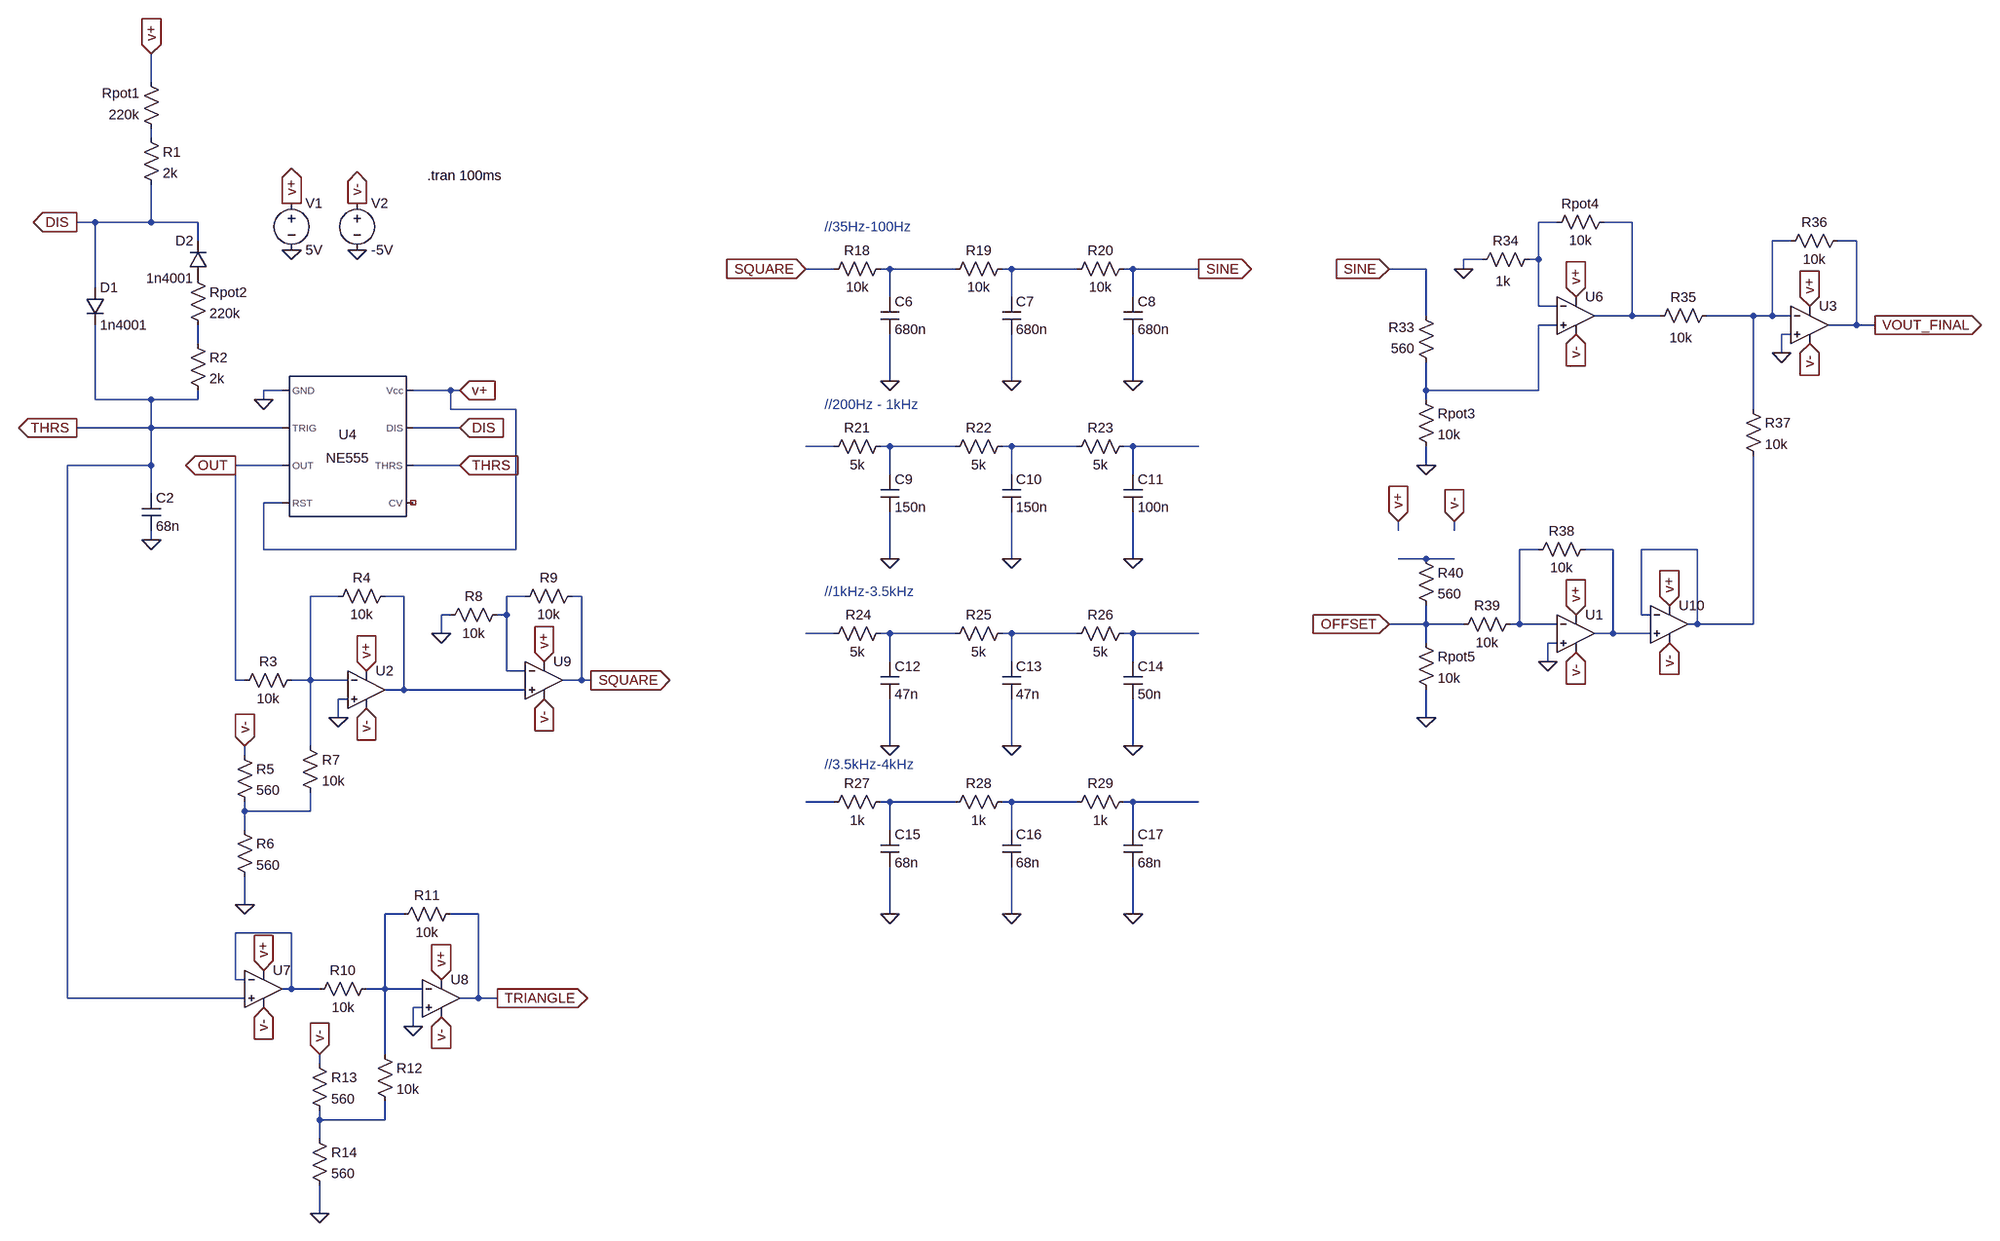
[diagram p0: schematic NE555 signal generator schematic.asc]
NE555 signal generator schematic.asc, the LTspice schematic file:
Version 4
SHEET 1 3212 2508
WIRE -1360 -400 -1360 -448
WIRE -1360 -304 -1360 -320
WIRE -1456 -160 -1488 -160
WIRE -1360 -160 -1360 -224
WIRE -1360 -160 -1456 -160
WIRE -1280 -160 -1360 -160
WIRE 1104 -160 1072 -160
WIRE 1232 -160 1184 -160
WIRE -1280 -128 -1280 -160
WIRE 1504 -128 1472 -128
WIRE 1616 -128 1584 -128
WIRE 976 -96 944 -96
WIRE 1072 -96 1072 -160
WIRE 1072 -96 1056 -96
WIRE -192 -80 -240 -80
WIRE -96 -80 -112 -80
WIRE 16 -80 -96 -80
WIRE 112 -80 96 -80
WIRE 224 -80 112 -80
WIRE 320 -80 304 -80
WIRE 432 -80 320 -80
WIRE 880 -80 816 -80
WIRE 944 -80 944 -96
WIRE -1456 -48 -1456 -160
WIRE -96 -32 -96 -80
WIRE 112 -32 112 -80
WIRE 320 -32 320 -80
WIRE 1072 -16 1072 -96
WIRE 1104 -16 1072 -16
WIRE 880 0 880 -80
WIRE 1232 0 1232 -160
WIRE 1232 0 1168 0
WIRE 1280 0 1232 0
WIRE 1440 0 1360 0
WIRE 1472 0 1472 -128
WIRE 1472 0 1440 0
WIRE 1504 0 1472 0
WIRE 1104 16 1072 16
WIRE 1616 16 1616 -128
WIRE 1616 16 1568 16
WIRE 1648 16 1616 16
WIRE 1504 32 1488 32
WIRE -1280 48 -1280 16
WIRE 1488 64 1488 32
WIRE -96 112 -96 32
WIRE 112 112 112 32
WIRE 320 112 320 32
WIRE -1136 128 -1168 128
WIRE -848 128 -912 128
WIRE -832 128 -848 128
WIRE 880 128 880 80
WIRE 1072 128 1072 16
WIRE 1072 128 880 128
WIRE -1456 144 -1456 16
WIRE -1360 144 -1456 144
WIRE -1280 144 -1280 128
WIRE -1280 144 -1360 144
WIRE -1168 144 -1168 128
WIRE 880 144 880 128
WIRE -848 160 -848 128
WIRE -736 160 -848 160
WIRE 1440 160 1440 0
WIRE -1360 192 -1360 144
WIRE -1360 192 -1488 192
WIRE -1136 192 -1360 192
WIRE -832 192 -912 192
WIRE -192 224 -240 224
WIRE -96 224 -112 224
WIRE 16 224 -96 224
WIRE 112 224 96 224
WIRE 224 224 112 224
WIRE 320 224 304 224
WIRE 432 224 320 224
WIRE -1360 256 -1360 192
WIRE -1360 256 -1504 256
WIRE -1136 256 -1216 256
WIRE -832 256 -912 256
WIRE 880 256 880 224
WIRE -96 272 -96 224
WIRE 112 272 112 224
WIRE 320 272 320 224
WIRE -1360 304 -1360 256
WIRE -1136 320 -1168 320
WIRE 832 368 832 352
WIRE 928 368 928 352
WIRE -1360 384 -1360 368
WIRE -1168 400 -1168 320
WIRE -736 400 -736 160
WIRE -736 400 -1168 400
WIRE 1072 400 1040 400
WIRE 1200 400 1152 400
WIRE 1344 400 1248 400
WIRE -96 416 -96 336
WIRE 112 416 112 336
WIRE 320 416 320 336
WIRE 880 416 832 416
WIRE 928 416 880 416
WIRE -1040 480 -1088 480
WIRE -928 480 -960 480
WIRE -720 480 -752 480
WIRE -624 480 -640 480
WIRE -848 512 -864 512
WIRE -752 512 -752 480
WIRE -752 512 -768 512
WIRE 1248 512 1248 400
WIRE 1264 512 1248 512
WIRE 880 528 880 496
WIRE 880 528 816 528
WIRE 944 528 880 528
WIRE 1040 528 1040 400
WIRE 1040 528 1024 528
WIRE 1104 528 1040 528
WIRE 1344 528 1344 400
WIRE 1344 528 1328 528
WIRE 1440 528 1440 240
WIRE 1440 528 1344 528
WIRE -864 544 -864 512
WIRE -192 544 -240 544
WIRE -96 544 -112 544
WIRE 16 544 -96 544
WIRE 112 544 96 544
WIRE 224 544 112 544
WIRE 320 544 304 544
WIRE 432 544 320 544
WIRE 1200 544 1200 400
WIRE 1200 544 1168 544
WIRE 1264 544 1200 544
WIRE 880 560 880 528
WIRE 1104 560 1088 560
WIRE -96 592 -96 544
WIRE 112 592 112 544
WIRE 320 592 320 544
WIRE 1088 592 1088 560
WIRE -752 608 -752 512
WIRE -720 608 -752 608
WIRE -1216 624 -1216 256
WIRE -1200 624 -1216 624
WIRE -1088 624 -1088 480
WIRE -1088 624 -1120 624
WIRE -1024 624 -1088 624
WIRE -624 624 -624 480
WIRE -624 624 -656 624
WIRE -608 624 -624 624
WIRE -928 640 -928 480
WIRE -928 640 -960 640
WIRE -720 640 -928 640
WIRE -1024 656 -1040 656
WIRE -1040 688 -1040 656
WIRE 880 688 880 640
WIRE -1088 736 -1088 624
WIRE -96 736 -96 656
WIRE 112 736 112 656
WIRE 320 736 320 656
WIRE -1200 752 -1200 736
WIRE -192 832 -240 832
WIRE -96 832 -112 832
WIRE 16 832 -96 832
WIRE 112 832 96 832
WIRE 224 832 112 832
WIRE 320 832 304 832
WIRE 432 832 320 832
WIRE -1200 848 -1200 832
WIRE -1088 848 -1088 816
WIRE -1088 848 -1200 848
WIRE -1200 880 -1200 848
WIRE -96 880 -96 832
WIRE 112 880 112 832
WIRE 320 880 320 832
WIRE -1200 1008 -1200 960
WIRE -928 1024 -960 1024
WIRE -800 1024 -848 1024
WIRE -96 1024 -96 944
WIRE 112 1024 112 944
WIRE 320 1024 320 944
WIRE -1120 1056 -1216 1056
WIRE -1216 1136 -1216 1056
WIRE -1200 1136 -1216 1136
WIRE -1120 1152 -1120 1056
WIRE -1120 1152 -1136 1152
WIRE -1072 1152 -1120 1152
WIRE -960 1152 -960 1024
WIRE -960 1152 -992 1152
WIRE -896 1152 -960 1152
WIRE -1504 1168 -1504 256
WIRE -1200 1168 -1504 1168
WIRE -800 1168 -800 1024
WIRE -800 1168 -832 1168
WIRE -768 1168 -800 1168
WIRE -896 1184 -912 1184
WIRE -912 1216 -912 1184
WIRE -960 1264 -960 1152
WIRE -1072 1280 -1072 1264
WIRE -1072 1376 -1072 1360
WIRE -960 1376 -960 1344
WIRE -960 1376 -1072 1376
WIRE -1072 1408 -1072 1376
WIRE -1072 1536 -1072 1488
FLAG -1120 -112 0
FLAG -1120 -192 v+
IOPIN -1120 -192 Out
FLAG 1648 16 VOUT_FINAL
IOPIN 1648 16 Out
FLAG -832 256 THRS
IOPIN -832 256 In
FLAG -1488 192 THRS
IOPIN -1488 192 Out
FLAG -832 192 DIS
IOPIN -832 192 In
FLAG -832 128 v+
IOPIN -832 128 In
FLAG -1008 -112 0
FLAG -1008 -192 v-
IOPIN -1008 -192 Out
FLAG 944 -80 0
FLAG 1536 -16 v+
IOPIN 1536 -16 In
FLAG 1536 48 v-
IOPIN 1536 48 In
FLAG 832 352 v+
IOPIN 832 352 In
FLAG 880 688 0
FLAG 816 528 OFFSET
IOPIN 816 528 In
FLAG 880 256 0
FLAG 928 352 v-
IOPIN 928 352 In
FLAG 112 1024 0
FLAG 320 1024 0
FLAG -96 736 0
FLAG 112 736 0
FLAG 320 736 0
FLAG -96 112 0
FLAG 112 112 0
FLAG 320 112 0
FLAG -768 1168 TRIANGLE
IOPIN -768 1168 Out
FLAG -1488 -160 DIS
IOPIN -1488 -160 Out
FLAG -96 1024 0
FLAG -1360 384 0
FLAG -1360 -448 v+
IOPIN -1360 -448 In
FLAG 1136 -32 v+
IOPIN 1136 -32 In
FLAG 1136 32 v-
IOPIN 1136 32 In
FLAG -1168 144 0
FLAG 1488 64 0
FLAG -992 608 v+
IOPIN -992 608 In
FLAG -992 672 v-
IOPIN -992 672 In
FLAG -1040 688 0
FLAG -1200 736 v-
IOPIN -1200 736 In
FLAG -1200 1008 0
FLAG -1168 1120 v+
IOPIN -1168 1120 In
FLAG -1168 1184 v-
IOPIN -1168 1184 In
FLAG -864 1136 v+
IOPIN -864 1136 In
FLAG -864 1200 v-
IOPIN -864 1200 In
FLAG -912 1216 0
FLAG -1072 1264 v-
IOPIN -1072 1264 In
FLAG -1072 1536 0
FLAG -608 624 SQUARE
IOPIN -608 624 Out
FLAG 816 -80 SINE
IOPIN 816 -80 In
FLAG -688 592 v+
IOPIN -688 592 In
FLAG -688 656 v-
IOPIN -688 656 In
FLAG -96 416 0
FLAG 112 416 0
FLAG 320 416 0
FLAG -864 544 0
FLAG 1136 512 v+
IOPIN 1136 512 In
FLAG 1136 576 v-
IOPIN 1136 576 In
FLAG 1088 592 0
FLAG 1296 496 v+
IOPIN 1296 496 In
FLAG 1296 560 v-
IOPIN 1296 560 In
FLAG 432 -80 SINE
IOPIN 432 -80 Out
FLAG -240 -80 SQUARE
IOPIN -240 -80 In
FLAG -1216 256 OUT
IOPIN -1216 256 Out
SYMBOL voltage -1120 -208 R0
WINDOW 123 0 0 Left 0
WINDOW 39 0 0 Left 0
SYMATTR InstName V1
SYMATTR Value 5V
SYMBOL res 1200 -176 R90
WINDOW 0 0 56 VBottom 2
WINDOW 3 32 56 VTop 2
SYMATTR InstName Rpot4
SYMATTR Value 10k
SYMBOL res 1072 -112 R90
WINDOW 0 0 56 VBottom 2
WINDOW 3 38 60 VTop 2
SYMATTR InstName R34
SYMATTR Value 1k
SYMBOL Misc\\NE555 -1024 224 R0
SYMATTR InstName U4
SYMBOL cap -1376 304 R0
SYMATTR InstName C2
SYMATTR Value 68n
SYMBOL res -1296 -80 R0
SYMATTR InstName Rpot2
SYMATTR Value 220k
SYMBOL voltage -1008 -208 R0
WINDOW 123 0 0 Left 0
WINDOW 39 0 0 Left 0
SYMATTR InstName V2
SYMATTR Value -5V
SYMBOL OpAmps\\UniversalOpAmp2 1536 16 R0
SYMATTR InstName U3
SYMBOL res 1376 -16 R90
WINDOW 0 0 56 VBottom 2
WINDOW 3 38 60 VTop 2
SYMATTR InstName R35
SYMATTR Value 10k
SYMBOL res 864 544 R0
SYMATTR InstName Rpot5
SYMATTR Value 10k
SYMBOL res 864 400 R0
SYMATTR InstName R40
SYMATTR Value 560
SYMBOL res 896 96 R180
WINDOW 0 36 76 Left 2
WINDOW 3 36 40 Left 2
SYMATTR InstName R33
SYMATTR Value 560
SYMBOL res 864 128 R0
SYMATTR InstName Rpot3
SYMATTR Value 10k
SYMBOL res -96 816 R90
WINDOW 0 0 56 VBottom 2
WINDOW 3 32 56 VTop 2
SYMATTR InstName R27
SYMATTR Value 1k
SYMBOL cap -112 880 R0
SYMATTR InstName C15
SYMATTR Value 68n
SYMBOL res -1344 -304 R180
WINDOW 0 36 76 Left 2
WINDOW 3 36 40 Left 2
SYMATTR InstName Rpot1
SYMATTR Value 220k
SYMBOL cap -112 592 R0
SYMATTR InstName C12
SYMATTR Value 47n
SYMBOL res -96 -96 R90
WINDOW 0 0 56 VBottom 2
WINDOW 3 32 56 VTop 2
SYMATTR InstName R18
SYMATTR Value 10k
SYMBOL cap -112 -32 R0
SYMATTR InstName C6
SYMATTR Value 680n
SYMBOL cap 96 -32 R0
SYMATTR InstName C7
SYMATTR Value 680n
SYMBOL cap 304 -32 R0
SYMATTR InstName C8
SYMATTR Value 680n
SYMBOL res 112 -96 R90
WINDOW 0 0 56 VBottom 2
WINDOW 3 32 56 VTop 2
SYMATTR InstName R19
SYMATTR Value 10k
SYMBOL res 320 -96 R90
WINDOW 0 0 56 VBottom 2
WINDOW 3 32 56 VTop 2
SYMATTR InstName R20
SYMATTR Value 10k
SYMBOL res 112 816 R90
WINDOW 0 0 56 VBottom 2
WINDOW 3 32 56 VTop 2
SYMATTR InstName R28
SYMATTR Value 1k
SYMBOL res 320 816 R90
WINDOW 0 0 56 VBottom 2
WINDOW 3 32 56 VTop 2
SYMATTR InstName R29
SYMATTR Value 1k
SYMBOL res 112 528 R90
WINDOW 0 0 56 VBottom 2
WINDOW 3 32 56 VTop 2
SYMATTR InstName R25
SYMATTR Value 5k
SYMBOL res 320 528 R90
WINDOW 0 0 56 VBottom 2
WINDOW 3 32 56 VTop 2
SYMATTR InstName R26
SYMATTR Value 5k
SYMBOL cap 96 592 R0
SYMATTR InstName C13
SYMATTR Value 47n
SYMBOL cap 304 592 R0
SYMATTR InstName C14
SYMATTR Value 50n
SYMBOL cap 96 880 R0
SYMATTR InstName C16
SYMATTR Value 68n
SYMBOL cap 304 880 R0
SYMATTR InstName C17
SYMATTR Value 68n
SYMBOL res -96 528 R90
WINDOW 0 0 54 VBottom 2
WINDOW 3 32 56 VTop 2
SYMATTR InstName R24
SYMATTR Value 5k
SYMBOL res 1424 144 R0
SYMATTR InstName R37
SYMATTR Value 10k
SYMBOL OpAmps\\UniversalOpAmp2 1136 0 R0
SYMATTR InstName U6
SYMBOL res 1488 -112 R270
WINDOW 0 32 56 VTop 2
WINDOW 3 0 56 VBottom 2
SYMATTR InstName R36
SYMATTR Value 10k
SYMBOL OpAmps\\UniversalOpAmp2 -992 640 R0
SYMATTR InstName U2
SYMBOL res -1104 608 R90
WINDOW 0 0 56 VBottom 2
WINDOW 3 32 56 VTop 2
SYMATTR InstName R3
SYMATTR Value 10k
SYMBOL res -944 464 R90
WINDOW 0 0 56 VBottom 2
WINDOW 3 32 56 VTop 2
SYMATTR InstName R4
SYMATTR Value 10k
SYMBOL res -1104 720 R0
SYMATTR InstName R7
SYMATTR Value 10k
SYMBOL res -1216 864 R0
SYMATTR InstName R6
SYMATTR Value 560
SYMBOL res -1216 736 R0
SYMATTR InstName R5
SYMATTR Value 560
SYMBOL OpAmps\\UniversalOpAmp2 -1168 1152 R0
SYMATTR InstName U7
SYMBOL OpAmps\\UniversalOpAmp2 -864 1168 R0
SYMATTR InstName U8
SYMBOL res -976 1136 R90
WINDOW 0 0 56 VBottom 2
WINDOW 3 32 56 VTop 2
SYMATTR InstName R10
SYMATTR Value 10k
SYMBOL res -832 1008 R90
WINDOW 0 0 56 VBottom 2
WINDOW 3 32 56 VTop 2
SYMATTR InstName R11
SYMATTR Value 10k
SYMBOL res -976 1248 R0
SYMATTR InstName R12
SYMATTR Value 10k
SYMBOL res -1088 1392 R0
SYMATTR InstName R14
SYMATTR Value 560
SYMBOL res -1088 1264 R0
SYMATTR InstName R13
SYMATTR Value 560
SYMBOL diode -1472 -48 R0
SYMATTR InstName D1
SYMATTR Value 1n4001
SYMBOL diode -1264 -64 R180
WINDOW 0 24 64 Left 2
WINDOW 3 24 0 Left 2
SYMATTR InstName D2
SYMATTR Value 1n4001
SYMBOL res -1376 -320 R0
SYMATTR InstName R1
SYMATTR Value 2k
SYMBOL res -1296 32 R0
SYMATTR InstName R2
SYMATTR Value 2k
SYMBOL OpAmps\\UniversalOpAmp2 -688 624 R0
SYMATTR InstName U9
SYMBOL res -624 464 R90
WINDOW 0 0 56 VBottom 2
WINDOW 3 32 56 VTop 2
SYMATTR InstName R9
SYMATTR Value 10k
SYMBOL res -96 208 R90
WINDOW 0 0 56 VBottom 2
WINDOW 3 32 56 VTop 2
SYMATTR InstName R21
SYMATTR Value 5k
SYMBOL cap -112 272 R0
SYMATTR InstName C9
SYMATTR Value 150n
SYMBOL res 112 208 R90
WINDOW 0 0 56 VBottom 2
WINDOW 3 32 56 VTop 2
SYMATTR InstName R22
SYMATTR Value 5k
SYMBOL cap 96 272 R0
SYMATTR InstName C10
SYMATTR Value 150n
SYMBOL res 320 208 R90
WINDOW 0 0 56 VBottom 2
WINDOW 3 32 56 VTop 2
SYMATTR InstName R23
SYMATTR Value 5k
SYMBOL cap 304 272 R0
SYMATTR InstName C11
SYMATTR Value 100n
SYMBOL res -752 496 R90
WINDOW 0 0 56 VBottom 2
WINDOW 3 32 56 VTop 2
SYMATTR InstName R8
SYMATTR Value 10k
SYMBOL OpAmps\\UniversalOpAmp2 1136 544 R0
SYMATTR InstName U1
SYMBOL res 1040 512 R90
WINDOW 0 0 56 VBottom 2
WINDOW 3 32 56 VTop 2
SYMATTR InstName R39
SYMATTR Value 10k
SYMBOL res 1168 384 R90
WINDOW 0 0 56 VBottom 2
WINDOW 3 32 56 VTop 2
SYMATTR InstName R38
SYMATTR Value 10k
SYMBOL OpAmps\\UniversalOpAmp2 1296 528 R0
SYMATTR InstName U10
TEXT -208 -152 Left 2 ;//35Hz-100Hz
TEXT -208 472 Left 2 ;//1kHz-3.5kHz
TEXT -208 768 Left 2 ;//3.5kHz-4kHz
TEXT -208 152 Left 2 ;//200Hz - 1kHz
TEXT -888 -240 Left 2 !.tran 100ms

The netlist it stands for:
* NE555 signal generator schematic.asc
V1 v+ 0 5V
Rpot4 N003 N002 10k
R34 N002 0 1k
XU4 0 THRS OUT v+ NC_01 THRS DIS v+ NE555  ; pins GND TRIG OUT RST CV THRS DIS Vcc
C2 THRS 0 68n
Rpot2 P001 N008 220k
V2 v- 0 -5V
XU3 0 N004 v+ v- VOUT_FINAL level2 Avol=1Meg GBW=10Meg Slew=10Meg Ilimit=25m Rail=0 Vos=0 En=0 Enk=0 In=0 Ink=0 Rin=500Meg  ; pins In+ In- V+ V- OUT
R35 N004 N003 10k
Rpot5 OFFSET 0 10k
R40 N016 OFFSET 560
R33 N007 SINE 560
Rpot3 N007 0 10k
R27 N025 N024 1k
C15 N025 0 68n
Rpot1 N001 v+ 220k
C12 N021 0 47n
R18 N005 SQUARE 10k
C6 N005 0 680n
C7 N006 0 680n
C8 SINE 0 680n
R19 N006 N005 10k
R20 SINE N006 10k
R28 N026 N025 1k
R29 N027 N026 1k
R25 N022 N021 5k
R26 N023 N022 5k
C13 N022 0 47n
C14 N023 0 50n
C16 N026 0 68n
C17 N027 0 68n
R24 N021 N020 5k
R37 N004 N015 10k
XU6 N007 N002 v+ v- N003 level2 Avol=1Meg GBW=10Meg Slew=10Meg Ilimit=25m Rail=0 Vos=0 En=0 Enk=0 In=0 Ink=0 Rin=500Meg  ; pins In+ In- V+ V- OUT
R36 N004 VOUT_FINAL 10k
XU2 0 N017 v+ v- N018 level2 Avol=1Meg GBW=10Meg Slew=10Meg Ilimit=25m Rail=0 Vos=0 En=0 Enk=0 In=0 Ink=0 Rin=500Meg  ; pins In+ In- V+ V- OUT
R3 N017 OUT 10k
R4 N018 N017 10k
R7 N017 N028 10k
R6 N028 0 560
R5 v- N028 560
XU7 THRS N030 v+ v- N030 level2 Avol=1Meg GBW=10Meg Slew=10Meg Ilimit=25m Rail=0 Vos=0 En=0 Enk=0 In=0 Ink=0 Rin=500Meg  ; pins In+ In- V+ V- OUT
XU8 0 N029 v+ v- TRIANGLE level2 Avol=1Meg GBW=10Meg Slew=10Meg Ilimit=25m Rail=0 Vos=0 En=0 Enk=0 In=0 Ink=0 Rin=500Meg  ; pins In+ In- V+ V- OUT
R10 N029 N030 10k
R11 TRIANGLE N029 10k
R12 N029 N031 10k
R14 N031 0 560
R13 v- N031 560
D1 DIS THRS 1n4001
D2 P001 DIS 1n4001
R1 N001 DIS 2k
R2 N008 THRS 2k
XU9 N018 N019 v+ v- SQUARE level2 Avol=1Meg GBW=10Meg Slew=10Meg Ilimit=25m Rail=0 Vos=0 En=0 Enk=0 In=0 Ink=0 Rin=500Meg  ; pins In+ In- V+ V- OUT
R9 SQUARE N019 10k
R21 N010 N009 5k
C9 N010 0 150n
R22 N011 N010 5k
C10 N011 0 150n
R23 N012 N011 5k
C11 N012 0 100n
R8 N019 0 10k
XU1 0 N013 v+ v- N014 level2 Avol=1Meg GBW=10Meg Slew=10Meg Ilimit=25m Rail=0 Vos=0 En=0 Enk=0 In=0 Ink=0 Rin=500Meg  ; pins In+ In- V+ V- OUT
R39 N013 OFFSET 10k
R38 N014 N013 10k
XU10 N014 N015 v+ v- N015 level2 Avol=1Meg GBW=10Meg Slew=10Meg Ilimit=25m Rail=0 Vos=0 En=0 Enk=0 In=0 Ink=0 Rin=500Meg  ; pins In+ In- V+ V- OUT
.model D D
.lib standard.dio
* //35Hz-100Hz
* //1kHz-3.5kHz
* //3.5kHz-4kHz
* //200Hz - 1kHz
.tran 100ms
.lib NE555.sub
.lib UniversalOpAmp2.lib
.backanno
.end